# EasyEDA Pro project CD_Power_supply.epro

# Schematic Schematic1
Board Name: Board1; Create Date: 2025-07-14; Page Name: P1; Project Name: Блок питания; Schematic Name: Schematic1; Update Date: 2025-07-14; Company: EasyEDA.com; Page Size: A4; Version: V1.0
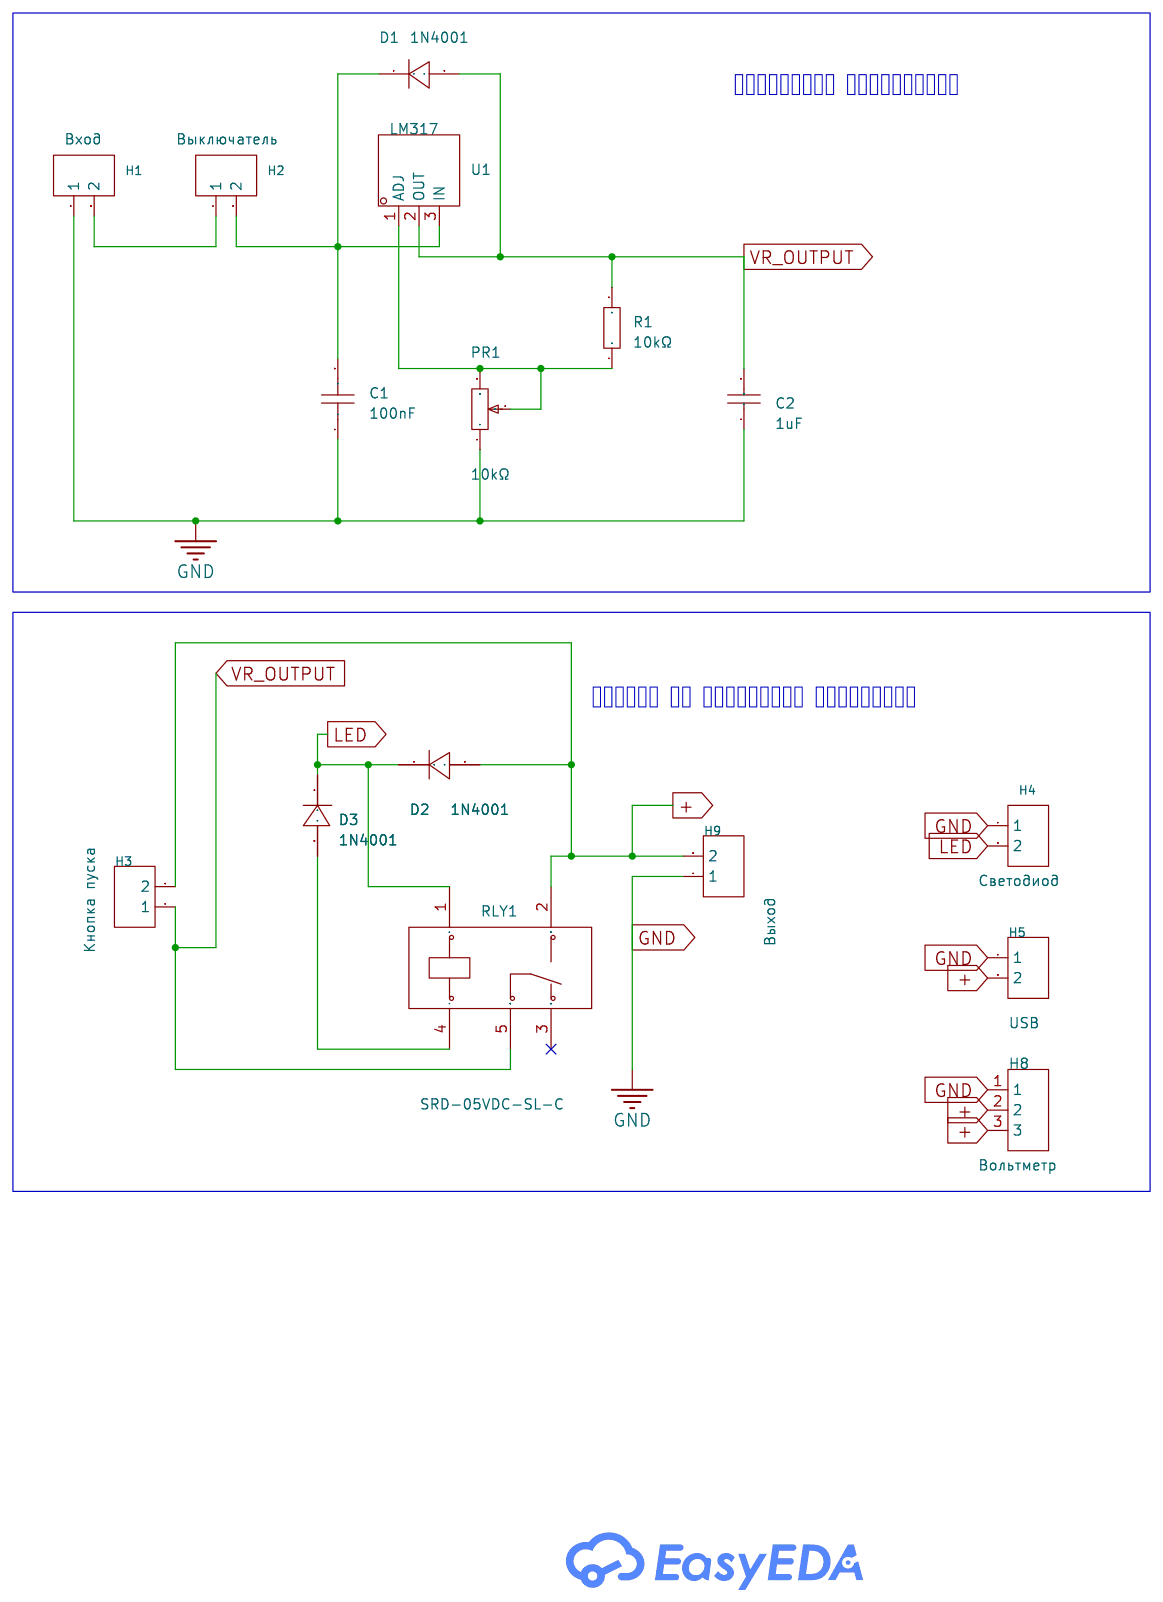
[diagram p0: schematic sheet]

## Parts
C1  100nF  [CAP-TH_L8.5-W5.0-P5.00-D1.2]
C2  1uF  [CAP-TH_L8.5-W5.0-P5.00-D1.2]
D1  1N4001  [DO-41_BD2.4-L4.7-P8.70-D0.9-RD]
D2  1N4001  [DO-41_BD2.4-L4.7-P8.70-D0.9-RD]
D3  1N4001  [DO-41_BD2.4-L4.7-P8.70-D0.9-RD]
H1  Вход  [HDR-TH_2P-P2.54-V-F]
H2  Выключатель  [HDR-TH_2P-P2.54-V-F]
H3  Кнопка пуска  [HDR-TH_2P-P2.54-V-F]
H4  Светодиод  [HDR-TH_2P-P2.54-V-F]
H5  USB  [HDR-TH_2P-P2.54-V-F]
H8  Вольтметр  [HDR-TH_3P-P2.54-V-F]
H9  Выход  [HDR-TH_2P-P2.54-V-F]
PR1  10kΩ  [RES-ADJ-TH_3P-L10.0-W10.0-P2.50-L]
R1  10kΩ  [R_AXIAL-0.4]
RLY1  SRD-05VDC-SL-C  [RELAY-TH_SRD-XXVDC-XL-C]
U1  LM317  [TO-220-3_L10.0-W4.5-P2.54-L]

## Library data of the parts
C1 = CT4-0805B104K500F3: Capacitance:100nF Tolerance:±10% Tolerance:±10% Voltage Rated: Temperature Coefficient:; LCSC Part Name: 100nF ±10% 50V C3型（直脚）; Supplier Part: C84772; Manufacturer: FH(风华); Supplier Footprint: 插件,P=5.08mm; JLCPCB Part Class: Extended Part; Datasheet: https://atta.szlcsc.com/upload/public/pdf/source/20190402/C385200_059806A6312B28FF1421A2413EB641E1.pdf; Supplier: LCSC; Tolerance: ±10%
C2 = CT4-0805B105K500F3: Capacitance:1uF Tolerance:±10% Tolerance:±10% Voltage Rating:50V Temperature Coefficient:X7R; LCSC Part Name: 1uF ±10% 50V; Supplier Part: C94708; Manufacturer: FH(风华); Supplier Footprint: 插件,P=5.08mm; JLCPCB Part Class: Extended Part; Datasheet: https://atta.szlcsc.com/upload/public/pdf/source/20190402/C385200_059806A6312B28FF1421A2413EB641E1.pdf; Supplier: LCSC; Tolerance: ±10%; Voltage Rating: 50V; Temperature Coefficient: X7R
D1-D3 = 1N4001: Diode Configuration: Forward Voltage (Vf@If): Reverse Voltage (Vr): Average Rectified Current (Io): Reverse Leakage Current:-; LCSC Part Name: 电压:50V 电流:1A; Supplier Part: C82804; Supplier Footprint: DO-41; Datasheet: https://atta.szlcsc.com/upload/public/pdf/source/20161024/1477288469199.pdf; Supplier: LCSC
H1-H5 H9 = HDR-F_2.54_1x2P: Supplier Footprint: Through
H8 = HDR-F_2.54_1x3P: Supplier Footprint: Through
PR1 = R_3296: Supplier Footprint: Through
R1 = Res_AXIAL-1/4W: Supplier Footprint: Through
RLY1 = SRD-05VDC-SL-C: Coil Voltage:5V Contact Form:一组转换:1C(SPDT-转换) Pin Number:5 Contact Rating:- Maximum Switching Voltage:250V@AC Coil Rated Power:360mW Maximum Switching Current:15A Coil Type:无极性-单线圈 Coil Resistance:70Ω Contact Resistance:100mΩ Operate Time:10ms Release Tim; LCSC Part Name: 蓝色; Supplier Part: C35449; Manufacturer: 松乐; Supplier Footprint: 插件,15.6x19.2mm; JLCPCB Part Class: Extended Part; Datasheet: https://atta.szlcsc.com/upload/public/pdf/source/20200305/C490149_C96E4098A3B1FFB377D5AD2E40B7C2A8.pdf; Supplier: LCSC; Coil Voltage: 5V; Contact Form: 一组转换:1C(SPDT-转换); Pin Number: 5; Maximum Switching Voltage: 250V@AC; Coil Rated Power: 360mW; Maximum Switching Current: 15A; Coil Type: 无极性-单线圈; Coil Resistance: 70Ω; Contact Resistance: 100mΩ; Operate Time: 10ms; Release Time: 10ms
U1 = LM317: Output Type: Maximum Input Voltage:- Output Voltage:1.2V~37V Output Voltage:1.2V~37V MAX Output Current:2.2A Power Supply Rejection Ratio (PSRR):80dB@(120Hz) Dropout Voltage:- Output Polarity:Positive electrode Number of Outputs:1; LCSC Part Name: ADJ 输出1.2V~37V 2.2A; Supplier Part: C358377; Manufacturer: BLUE ROCKET(蓝箭); Supplier Footprint: TO-220; Datasheet: https://atta.szlcsc.com/upload/public/pdf/source/20190129/C358377_320697A0243575D6E7F47A89E37E80CE.pdf; Supplier: LCSC; Output Voltage: 1.2V~37V; MAX Output Current: 2.2A; Power Supply Rejection Ratio (PSRR): 80dB@(120Hz); Output Polarity: Positive electrode; Number of Outputs: 1

## Nets
GND: C1.1 C2.1 H1.1 H4.1 H5.1 H8.1 H9.1 PR1.1
+: D2.2(A) H3.2 H5.2 H8.2 H8.3 H9.2 RLY1.2
LED: D2.1(K) D3.1(K) H4.2 RLY1.1
VR_OUTPUT: C2.2 D1.2(A) H3.1 R1.2 RLY1.5 U1.2(OUT)
Net-(C1-2): C1.2 D1.1(K) H2.2 U1.3(IN)
Net-(D3-2): D3.2(A) RLY1.4
Net-(H1-2): H1.2 H2.1
Net-(PR1-2): PR1.2 PR1.3 R1.1 U1.1(ADJ)

Not connected (* = marked no-connect by the designer): RLY1 3*

## Notes on the sheet
- Регулятор напряжения
- Защита от короткого замыкания
